# EAGLE design FM VCO Transmitter (EAGLE 6.4)
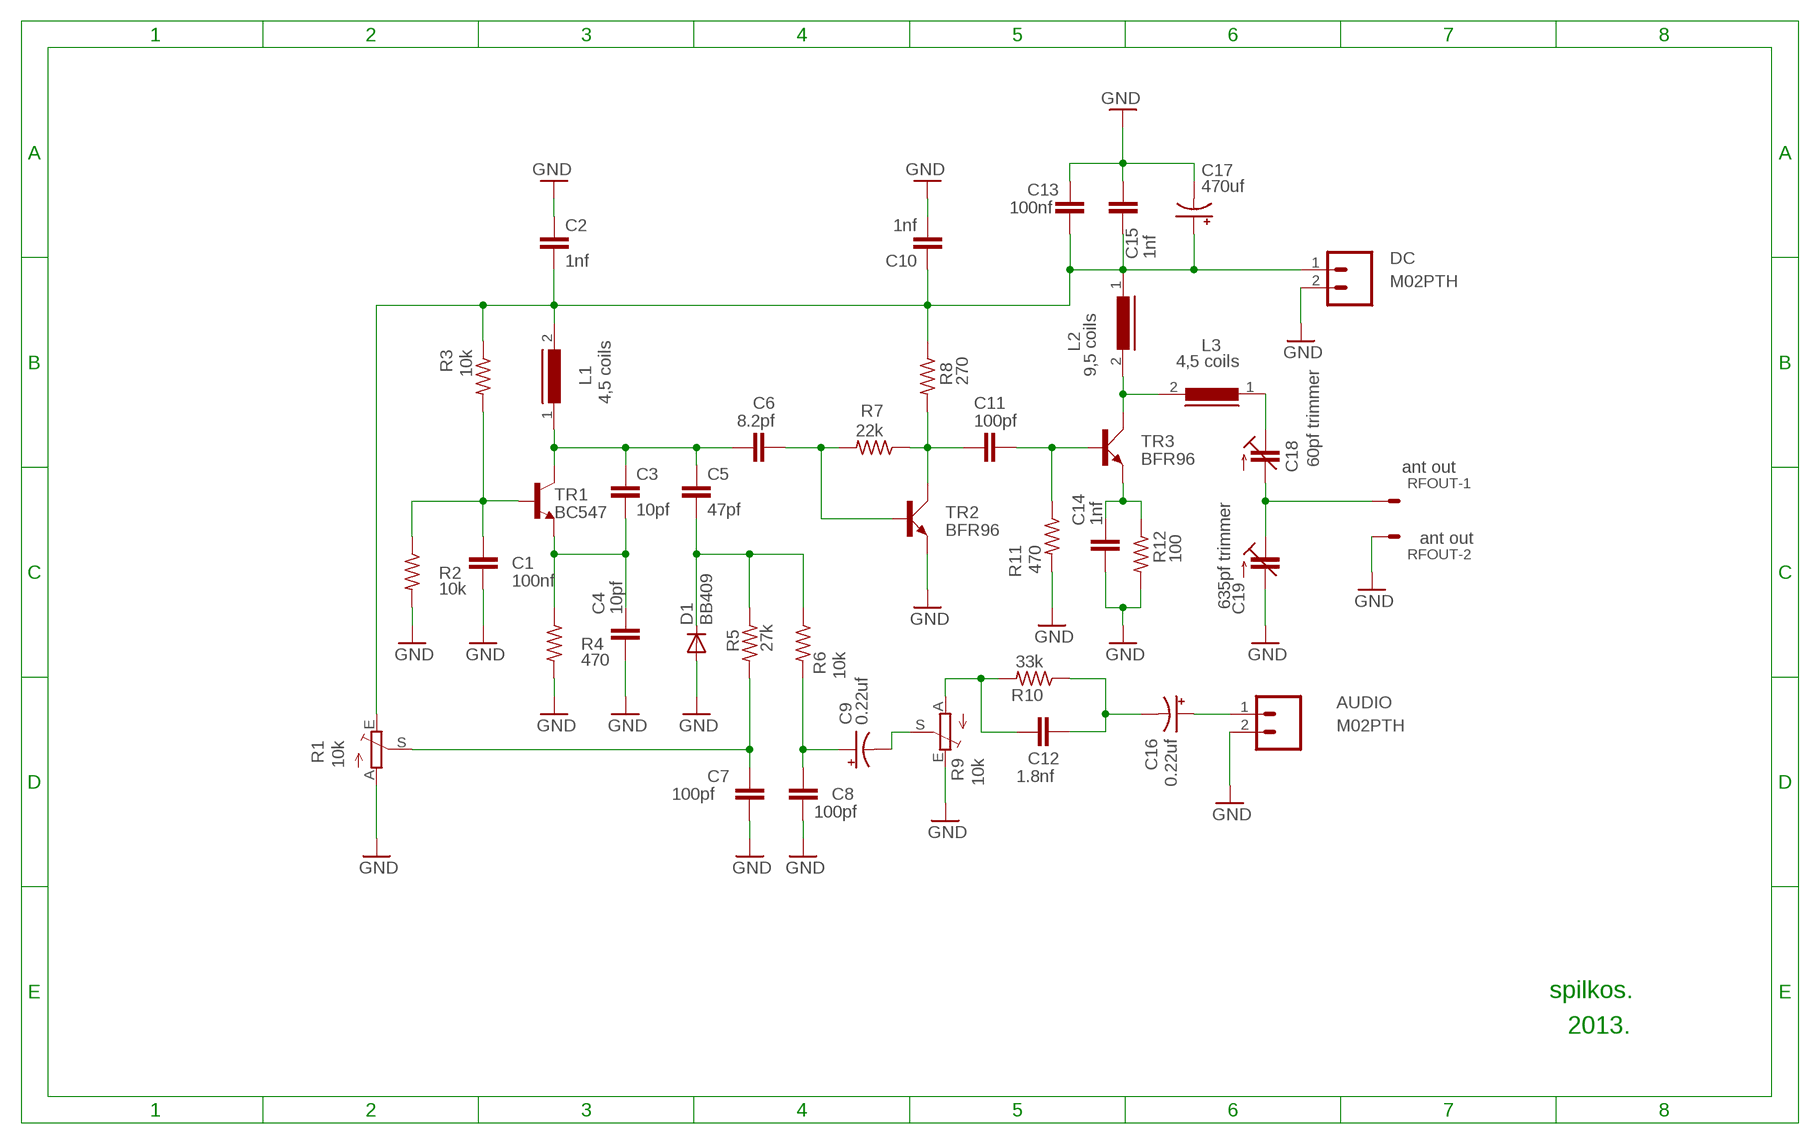
[diagram p0: schematic, sheet 1]

## Parts
AUDIO  M02PTH  [1X02]
C1  100nf  C-EU025-024X044  [C025-024X044]
C2  1nf  C-EU025-024X044  [C025-024X044]
C3  10pf  C-EU025-024X044  [C025-024X044]
C4  10pf  C-EU025-024X044  [C025-024X044]
C5  47pf  C-EU025-024X044  [C025-024X044]
C6  8.2pf  C-EU025-024X044  [C025-024X044]
C7  100pf  C-EU025-024X044  [C025-024X044]
C8  100pf  C-EU025-024X044  [C025-024X044]
C9  0.22uf  CPOL-USE2,5-6E  [E2,5-6E]
C10  1nf  C-EU025-024X044  [C025-024X044]
C11  100pf  C-EU025-024X044  [C025-024X044]
C12  1.8nf  C-EU025-024X044  [C025-024X044]
C13  100nf  C-EU025-024X044  [C025-024X044]
C14  1nf  C-EU025-024X044  [C025-024X044]
C15  1nf  C-EU025-024X044  [C025-024X044]
C16  0.22uf  CPOL-USE2,5-6E  [E2,5-6E]
C17  470uf  CPOL-USE2,5-6E  [E2,5-6E]
C18  60pf trimmer  C-TRIMMTZ03  [CTRIMTZ03]
C19  635pf trimmer  C-TRIMMTZ03  [CTRIMTZ03]
D1  BB409  BA243A  [DO35-10]
DC  M02PTH  [1X02]
L1  4,5 coils  82114R  [82114R]
L2  9,5 coils  82114R  [82114R]
L3  4,5 coils  82114R  [82114R]
R1  10k  TRIM_EU-B25P  [B25P]
R2  10k  R-US_0309/V  [0309V]
R3  10k  R-US_0309/V  [0309V]
R4  470  R-US_0309/V  [0309V]
R5  27k  R-US_0309/V  [0309V]
R6  10k  R-US_0309/V  [0309V]
R7  22k  R-US_0309/V  [0309V]
R8  270  R-US_0309/V  [0309V]
R9  10k  TRIM_EU-B25P  [B25P]
R10  33k  R-US_0309/V  [0309V]
R11  470  R-US_0309/V  [0309V]
R12  100  R-US_0309/V  [0309V]
RFOUT  ant out  332-02  [332-02]
TR1  BC547  [TO92]
TR2  BFR96  [SOT37]
TR3  BFR96  [SOT37]

## Nets
GND: AUDIO.2 C1.2 C2.1 C4.2 C7.2 C8.2 C10.2 C13.1 C14.2 C15.1 C17.- C19.2(A) D1.A DC.2 R1.A R2.2 R4.2 R9.E R11.2 R12.2 RFOUT.2 TR2.2(E)
N$1: C3.2 C4.1 R4.1 TR1.1(E)
N$4: C7.1 R1.S R5.2
N$5: C1.1 R2.1 R3.2 TR1.2(B)
N$6: C8.1 C9.+ R6.2
N$8: C11.1 R7.1 R8.2 TR2.1(C)
N$9: C9.- R9.S
N$10: C12.1 R9.A R10.2
N$11: C12.2 C16.- R10.1
N$13: C14.1 R12.1 TR3.2(E)
N$15: L2.2 L3.2 TR3.1(C)
N$16: C18.1(E) L3.1
N$17: C18.2(A) C19.1(E) RFOUT.1
N$18: AUDIO.1 C16.+
WIRE_1: C3.1 C5.1 C6.1 L1.1 TR1.3(C)
WIRE_2: C5.2 D1.C R5.1 R6.1
WIRE_3: C6.2 R7.2 TR2.3(B)
WIRE_4: C2.2 C10.1 C13.2 C15.2 C17.+ DC.1 L1.2 L2.1 R1.E R3.1 R8.1
WIRE_5: C11.2 R11.1 TR3.3(B)

## Notes on the sheet
- spilkos.
- 2013.

## Library data of the parts
AUDIO DC = SparkFun-Connectors:M02: Standard 2-pin 0.1" header. Use with - straight break away headers ( PRT-00116) - right angle break away headers (PRT-00553) - swiss pins (PRT-00743) - machine pins (PRT-00117) - female headers (PRT-00115) Molex polarized connector foot print use with: PRT-08233 with associated crimp pins and housings. 2.54_SCREWTERM for use with PRT-10571. 3.5mm Screw Terminal footprints for PRT-08084 5mm Screw Terminal footprints for use with PRT-08433
C1-C8 C10-C15 = rcl:C-EU: CAPACITOR, European symbol
C9 C16 C17 = adafruit:CPOL-US: POLARIZED CAPACITOR, American symbol
C18 C19 = rcl:C-TRIMM: Trimm capacitor
D1 = diode:BA243A: DIODE
L1-L3 = inductors:82114R: INDUCTOR
R1 R9 = pot:TRIM_EU-: POTENTIOMETER
R2-R8 R10-R12 = adafruit:R-US_: RESISTOR, American symbol
RFOUT = con-garry:332-02: 2 Pin - 2mm Dual Row Source: www.mpe-connector.de / garry_shortform_2012.pdf
TR1 = transistor-npn:BC547*: NPN Transistor
TR2 TR3 = transistor-small-signal:BFR96: NPN Silicon High-Frequency Transistor Source: http://www.ee.siue.edu/~alozows/library/datasheets/BFR96.pdf

## Board
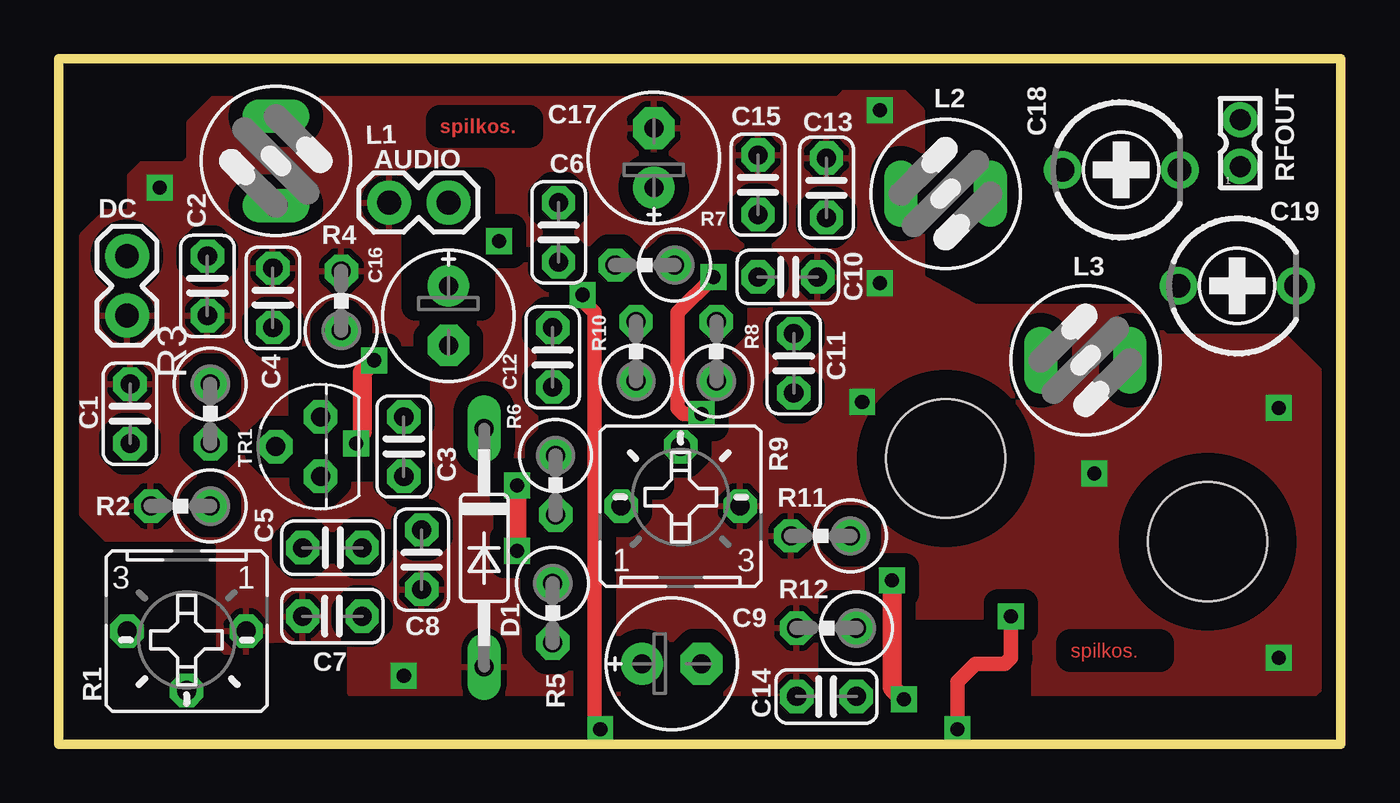
[diagram p1: board, top side]
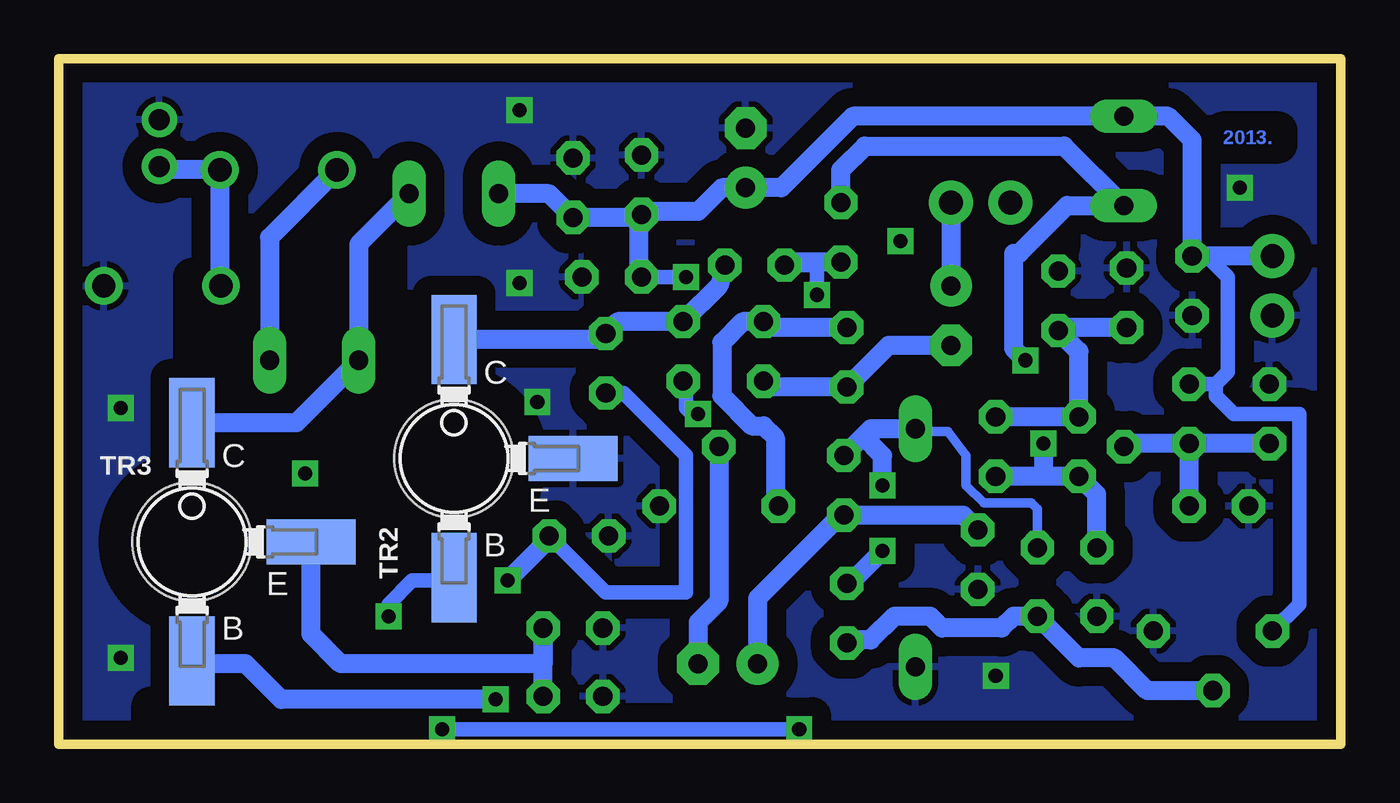
[diagram p2: board, bottom side, seen from below]

Size 54.72 x 29.26 mm. Coordinates in mm from the lower left corner, seen from the top.
Outline: 0,0 54.72,0 54.72,29.26 0,29.26 0,0
Copper layers (1*16): Top 0.035mm / dielectric 1.5mm / Bottom 0.035mm
Design rules "SparkFun": minimum track width 8mil, minimum drill 20mil, track to track 8mil, track to pad 8mil, pad to pad 8mil, via to via 8mil, smd to smd 8mil, copper to edge 10mil, drill to drill 8mil, minimum pad ring 12mil, minimum via ring 10mil, stop-mask expansion 4mil, vias tented up to drill 25mil, thermal gap 10mil
tRestrict: area 23.4,15.9 to 26.2,19.7; area 21.1,16.1 to 22.6,17.1; area 20.3,5.2 to 22.1,9; area 24.9,1.7 to 27.7,2.4; area 36.1,1.7 to 40.9,4.7; area 10.4,11.8 to 15.2,16.4; area 15.2,18.7 to 18,24; area 33,2.4 to 35.3,6; area 21.1,11 to 25.7,14.4
bRestrict: area 16.5,10.8 to 18.5,12.1; area 21.8,10.5 to 23.4,13.8; area 24.1,7.5 to 25.7,9; area 11.4,9 to 12.4,10.3; area 11.9,21.2 to 16.5,25; area 20.1,21.2 to 26.7,22.5; area 18,22.5 to 20.6,24.5; area 18,17.9 to 20.1,20.4; area 14.7,14.6 to 19.3,16.1; area 28.7,15.6 to 31.5,17.1; area 30.2,18.7 to 31.5,21.7; area 24.9,1.4 to 27.7,2.2; 9 more areas

### Footprints (pad centres in the part's own frame; a part is rotated, then mirrored left to right if it is on the bottom)
1X02 = drill 1.016 pad 1.88: 1 0,0; 2 2.54,0
C025-024X044 = drill 0.813 octagon: 1 -1.27,0; 2 1.27,0
E2,5-6E = drill 0.813 pad 1.778: + -1.27,0 | drill 0.813 pad 1.778 octagon: - 1.27,0
CTRIMTZ03 = drill 1: 1 0,2.5; 2 0,-2.5
DO35-10 = drill 0.813 long: A 5.08,0; C -5.08,0
82114R = drill 0.813 long: 1 0,1.905; 2 0,-1.905
B25P = drill 0.813 octagon: A -2.54,0; E 2.54,0; S 0,2.54
0309V = drill 0.813 octagon: 1 -1.27,0; 2 1.27,0
332-02 = drill 0.9 pad 1.27: 1 0,-1; 2 0,1
TO92 = drill 0.813 octagon: 1 1.27,0; 2 0,1.905; 3 -1.27,0
SOT37 = smd 1.93 x 3.81: 1 0,5.08; 3 0,-5.08 | smd 3.81 x 1.93: 2 5.08,0 | hole 5.08: 0,0

### Placement (x,y rotation side)
AUDIO  16.64,23.11 180 top
C1  3.05,14.1 90 top
C2  6.35,19.56 90 top
C3  14.73,12.7 90 top
C4  9.14,19.05 90 top
C5  11.68,8.38 0 top
C6  21.34,21.84 270 top
C7  11.68,5.46 180 top
C8  15.49,7.87 270 top
C9  26.16,3.43 0 top
C10  31.12,19.94 0 top
C11  31.37,16.26 270 top
C12  21.08,16.51 270 top
C13  32.77,23.75 270 top
C14  32.77,2.03 180 top
C15  29.85,23.88 270 top
C16  16.64,18.29 270 top
C17  25.4,25.02 90 top
C18  45.34,24.51 90 top
C19  50.29,19.56 90 top
D1  18.16,8.38 270 top
DC  2.92,20.83 270 top
L1  9.27,24.89 180 top
L2  37.85,23.49 90 top
L3  43.82,16.38 270 top
R1  5.46,4.83 180 top
R2  5.21,10.16 180 top
R3  6.48,14.1 270 top
R4  12.07,18.92 90 top
R5  21.08,5.59 270 top
R6  21.21,11.05 270 top
R7  25.02,20.45 180 top
R8  28.07,16.76 90 top
R9  26.54,10.16 0 top
R10  24.64,16.76 90 top
R11  32.51,8.89 180 top
R12  32.77,4.95 180 top
RFOUT  50.42,25.65 0 top
TR1  11.18,12.7 90 top
TR2  37.85,12.19 0 bottom
TR3  49.02,8.64 0 bottom

### Tracks (layer width: path | path; a pad name or v marks a point on that pad's centre or on a via)
GND  (via drill 0.6)
  other vias: 4.32,23.75 35.05,27.05 52.07,3.68 52.07,14.35 44.2,11.56 14.73,2.92 35.05,19.68 34.29,14.6
  pour Bottom (isolate 0.813): 0,29.34 54.61,29.34 54.61,-0.38 0,-0.13
  pour Top (isolate 0.61): 3.05,22.73 3.05,24.26 3.56,24.77 5.33,24.77 5.59,25.02 5.59,26.54 6.6,27.56 33.27,27.56 33.53,27.81 36.07,27.81 36.83,27.05 36.83,19.94 39.12,18.67 45.97,18.67 47.24,17.4 52.32,17.4 53.85,15.87 53.85,2.41 53.59,2.16 12.45,2.16 12.45,4.19 12.19,4.45 9.14,4.45 8.64,3.94 7.11,3.94 6.86,4.19 6.86,8.51 6.6,8.76 2.03,8.76 1.02,9.78 1.02,21.72 2.03,22.73
N$1
  Bottom 0.813: C3.2 TR1.1 11.18,16.76 R4.1 11.94,17.78 C4.1
N$4
  Bottom 0.813: R5.2 20.96,4.45 20.07,4.45 19.05,5.46 17.53,5.46 17.02,4.95 14.48,4.95 13.97,5.46 C7.1 11.18,3.68 9.65,3.68 8.26,2.29 R1.S
N$5
  Bottom 0.813: C1.1 R3.2 | R3.2 9.14,12.83 TR1.2 | R2.1 R3.2
N$6
  Bottom 0.813: C9.+ 24.89,6.22 21.34,9.78 R6.2 16.13,9.78 C8.1
N$8
  Bottom 0.813: TR2.1 31.62,17.27 C11.1 30.86,18.03 R8.2 26.54,19.56 R7.1
N$9
  Bottom 0.813: R9.S 26.54,6.1 27.43,5.21 C9.-
N$10
  Bottom 0.813: C12.1 24.38,17.78 R10.2 25.53,18.03 26.42,17.14 26.42,14.86 25.15,13.59 24.64,13.59 24.13,13.08 24.13,10.29 R9.A
N$11
  Bottom 0.813: C16.- 19.3,17.02 C12.2 24.38,15.24 R10.1
N$13
  Bottom 0.813: C14.1 R12.1 34.04,3.43 42.67,3.43 43.94,4.7 TR3.2
N$15
  Bottom 0.813: L2.2 41.91,21.34 L3.2 44.58,13.72 TR3.1
N$16
  Bottom 0.813: C18.1 45.72,21.63 L3.1
N$17
  Bottom 0.813: RFOUT.1 50.28,24.51 C18.2 47.84,19.6 C19.1
N$18
  Bottom 0.813: AUDIO.1 C16.+
N$24  (via drill 0.6)
  other vias: 18.8,21.46
WIRE_1  (via drill 0.6)
  Top 0.813: v13.46,16.38 12.95,15.87 12.95,13.33 v12.7,12.83
  Bottom 0.813: C6.1 21.34,24.51 20.32,25.53 11.81,25.53 L1.1 11.68,22.99 13.72,20.95 13.97,20.95 13.97,16.89 v13.46,16.38 | 12.7,11.43 TR1.3 10.41,10.67 C5.1 | 12.7,11.43 C3.1 | v12.7,12.83 12.7,11.43
WIRE_2  (via drill 0.6)
  Top 0.813: v19.56,8.25 v19.56,11.05
  Bottom 0.305: 18.03,13.33 D1.C
  Bottom 0.406: C5.2 12.95,10.03 13.21,10.29 15.24,10.29 16,11.05 16,12.32 16.76,13.33 18.03,13.33
  Bottom 0.813: D1.C 20.07,13.46 20.38,13.14 | 20.38,13.14 R6.1 | R5.1 20.96,6.86 v19.56,8.25 | v19.56,11.05 19.56,12.32 20.38,13.14
WIRE_3  (via drill 0.6)
  Top 0.61: v22.35,19.18 22.35,18.92 22.86,18.41 22.86,0.89 v23.11,0.63 | v38.35,0.63 38.35,2.67 39.12,3.43 40.39,3.43 40.64,3.68 v40.64,5.46
  Bottom 0.61: R7.2 22.35,20.45 v22.35,19.18 | v23.11,0.63 v38.35,0.63 | v40.64,5.46 40.64,5.97 39.62,6.98 37.97,6.98 TR2.3
  Bottom 0.813: C6.2 23.62,20.57 R7.2
WIRE_4  (via drill 0.6)
  Top 0.61: v27.94,19.94 26.42,18.41 26.42,14.35 26.67,14.1 v27.43,14.1
  Bottom 0.61: C2.2 5.72,20.83 4.83,19.94 4.83,15.87 5.33,15.37 | 5.33,15.37 R3.1 | 5.33,15.37 5.33,14.86 4.57,14.1 1.78,14.1 1.78,5.97 R1.E | C10.1 v27.94,19.94 | v27.43,14.1 27.69,14.1 27.94,14.35 27.94,15.37 R8.1
  Bottom 0.813: L2.1 33.78,23.49 C13.2 29.97,22.48 | 29.97,22.48 C15.2 29.72,22.73 27.43,22.73 26.42,23.75 C17.+ 23.88,23.75 20.83,26.8 L1.2 7.37,26.8 6.35,25.78 C2.2 DC.1 | 29.97,22.48 29.97,20.07 C10.1
WIRE_5  (via drill 0.6)
  Top 0.813: v35.56,6.98 35.56,2.41 v36.07,1.9
  Bottom 0.61: C11.2 30.61,14.99 27.94,12.32 27.94,6.48 31.37,6.48 R11.1
  Bottom 0.813: R11.1 33.78,8.76 v35.56,6.98 | v36.07,1.9 45.21,1.9 46.74,3.43 48.9,3.43 TR3.3

### Text on the board
Top: spilkos. | spilkos.
Bottom: 2013.